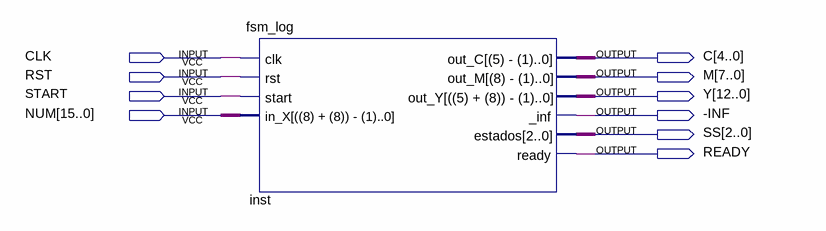
[diagram p0: schematic sheet]
// Quartus schematic LogBin.bdf as structural Verilog: 1 symbols, 10 pins
module LogBin (
  input  CLK,
  input  RST,
  input  START,
  input  [15:0] NUM,
  output [4:0] C,
  output [7:0] M,
  output [12:0] Y,
  output \-INF ,
  output [2:0] SS,
  output READY
);

  fsm_log inst (
    .clk(CLK), .rst(RST), .start(START), .\in_X[((8)_+_(8))_-_(1)..0] (NUM), .\out_C[(5)_-_(1)..0] (C),
    .\out_M[(8)_-_(1)..0] (M), .\out_Y[((5)_+_(8))_-_(1)..0] (Y), ._inf(\-INF ), .estados(SS), .ready(READY));
endmodule
